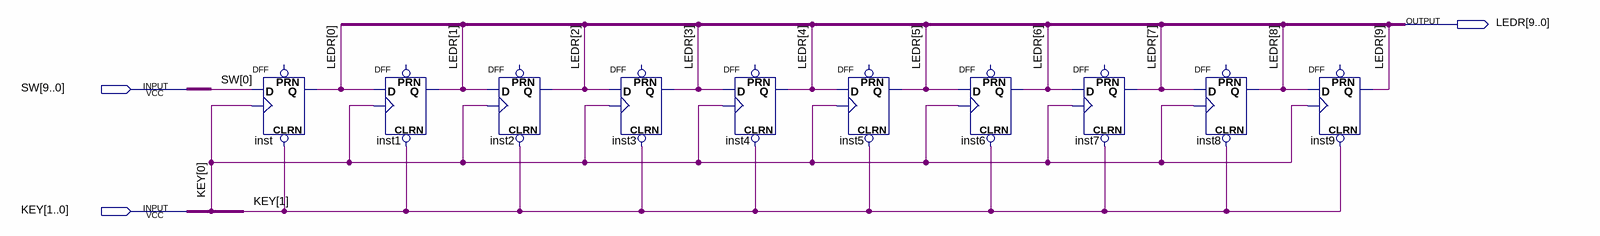
[diagram p0: schematic sheet]
// Quartus schematic shift_reg.bdf as structural Verilog: 10 symbols, 3 pins
module shift_reg (
  input  [9:0] SW,
  input  [1:0] KEY,
  output [9:0] LEDR
);

  DFF inst (.CLRN(KEY[1]), .CLK(KEY[0]), .D(SW[0]), .Q(LEDR[0]));  // open: PRN
  DFF inst1 (.CLRN(KEY[1]), .CLK(KEY[0]), .D(LEDR[0]), .Q(LEDR[1]));  // open: PRN
  DFF inst2 (.CLRN(KEY[1]), .CLK(KEY[0]), .D(LEDR[1]), .Q(LEDR[2]));  // open: PRN
  DFF inst3 (.CLRN(KEY[1]), .CLK(KEY[0]), .D(LEDR[2]), .Q(LEDR[3]));  // open: PRN
  DFF inst4 (.CLRN(KEY[1]), .CLK(KEY[0]), .D(LEDR[3]), .Q(LEDR[4]));  // open: PRN
  DFF inst5 (.CLRN(KEY[1]), .CLK(KEY[0]), .D(LEDR[4]), .Q(LEDR[5]));  // open: PRN
  DFF inst6 (.CLRN(KEY[1]), .CLK(KEY[0]), .D(LEDR[5]), .Q(LEDR[6]));  // open: PRN
  DFF inst7 (.CLRN(KEY[1]), .CLK(KEY[0]), .D(LEDR[6]), .Q(LEDR[7]));  // open: PRN
  DFF inst8 (.CLRN(KEY[1]), .CLK(KEY[0]), .D(LEDR[7]), .Q(LEDR[8]));  // open: PRN
  DFF inst9 (.CLRN(KEY[1]), .CLK(KEY[0]), .D(LEDR[8]), .Q(LEDR[9]));  // open: PRN
endmodule
